# Altium schematic sheet FC-Shield.SchDoc
size A4
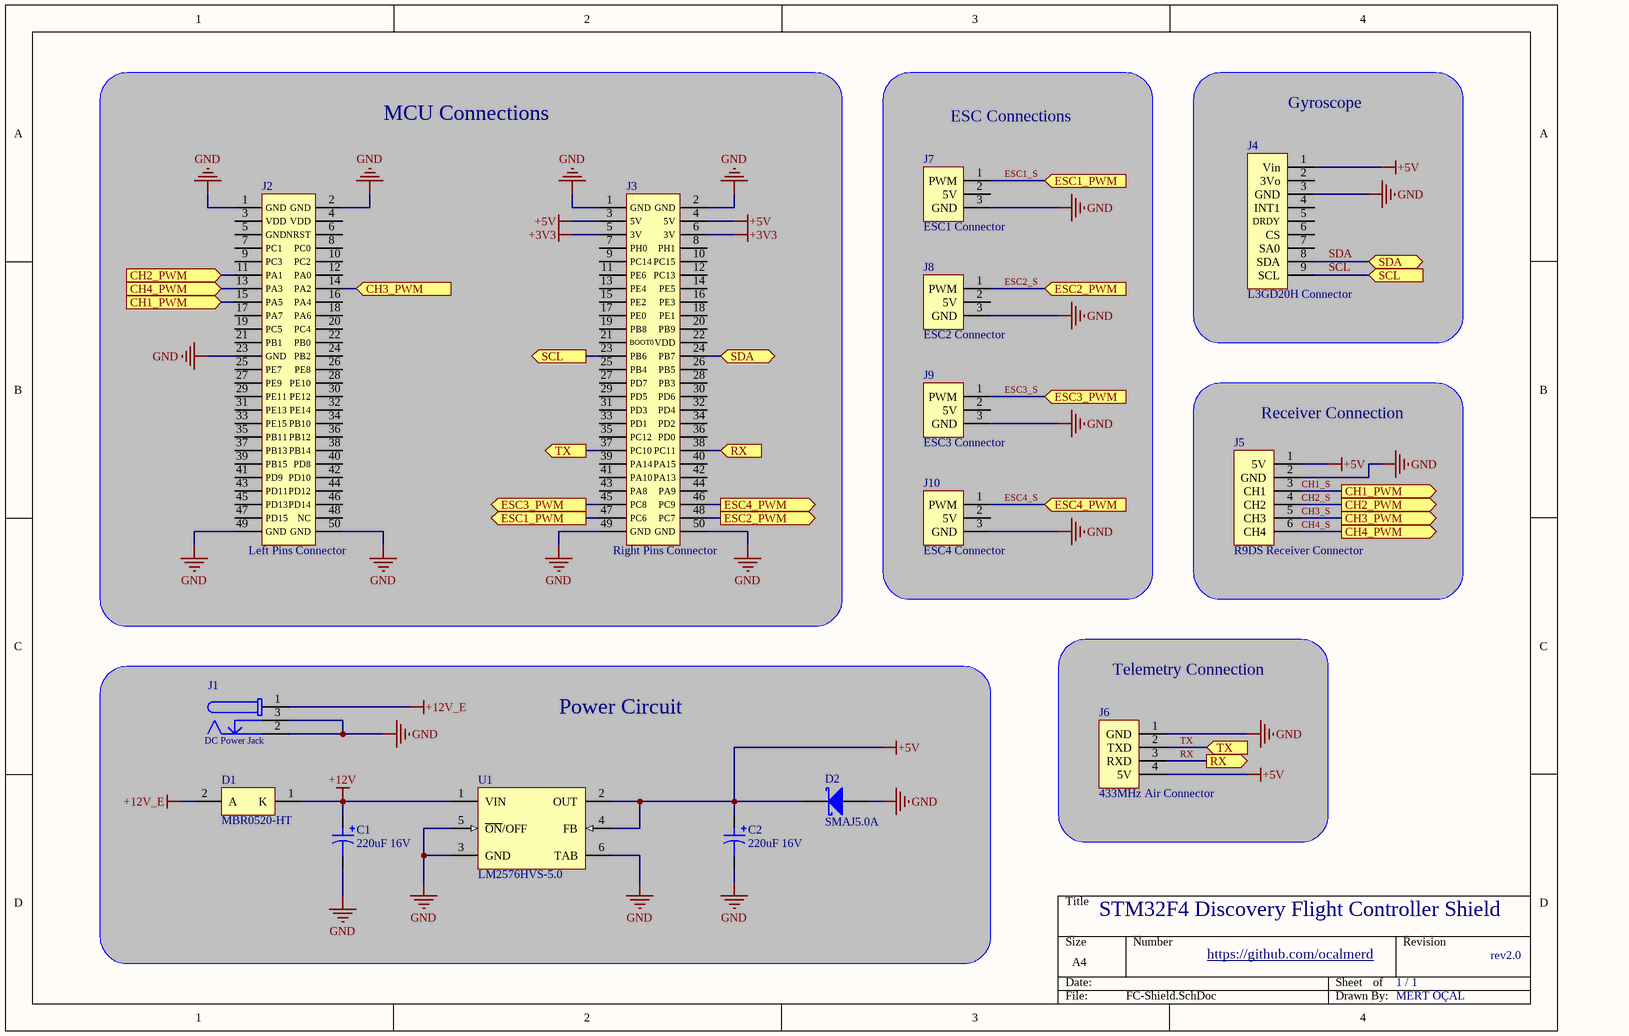
[diagram p0: FC-Shield.SchDoc]

## Parts
C1  Deger: 220uF 16V  [CAP ALUM 6.6MM]  (hidden comment: CAP ALUM 220UF 20% 16V SMD)
C2  Deger: 220uF 16V  [CAP ALUM 6.6MM]  (hidden comment: CAP ALUM 220UF 20% 16V SMD)
D1  MBR0520-HT  [ONSC-SOD-123-2-425-04_V]
D2  SMAJ5.0A TVS Diyot  [DO214AC SMA]  (value not drawn)
J1  DC Power Jack  [694106301002]
J2  Left Pins Connector  [HDR2X25]
J3  Right Pins Connector  [HDR2X25]
J4  L3GD20H Connector  [HDR1X9]
J5  R9DS Receiver Connector  [HDR1X6H]
J6  433MHz Air Connector  [HDR1X4H]
J7  ESC1 Connector  [HDR1X3H]
J8  ESC2 Connector  [HDR1X3H]
J9  ESC3 Connector  [HDR1X3H]
J10  ESC4 Connector  [HDR1X3H]
U1  Deger: LM2576HVS-5.0  [TO-263-6]  (hidden comment: LM2576HVS-5.0 REG BUCK 5V 3A TO263-5)

## Blocks framed on the sheet
MCU Connections: J2 J3
ESC Connections: J7-J10
Gyroscope: J4
Receiver Connection: J5
Power Circuit: C1 C2 D1 D2 J1 U1
Telemetry Connection: J6

## Ports
CH1_PWM (in), CH1_PWM (out), CH2_PWM (in), CH2_PWM (out), CH3_PWM (in), CH3_PWM (out), CH4_PWM (in), CH4_PWM (out), ESC1_PWM (in), ESC1_PWM (out), ESC2_PWM (in), ESC2_PWM (out), ESC3_PWM (in), ESC3_PWM (out), ESC4_PWM (in), ESC4_PWM (out), RX (in), RX (out), SCL (in), SCL (out), SDA (bidir), TX (in), TX (out)

## Nets
+3V3: J3.5(3V) J3.6(3V)
+5V: C2.1 D2.2(K) J3.3(5V) J3.4(5V) J4.1(Vin) J5.1(5V) J6.4(5V) U1.2(OUT) U1.4(FB)
+12V: C1.1 D1.1(K) U1.1(VIN)
+12V_E: D1.2(A) J1.1
GND: C1.2 C2.2 D2.1(A) J1.2 J1.3 J2.1(GND) J2.2(GND) J2.23(GND) J2.49(GND) J2.50(GND) J3.1(GND) J3.2(GND) J3.49(GND) J3.50(GND) J4.3(GND) J5.2(GND) J6.1(GND) J7.3(GND) J8.3(GND) J9.3(GND) J10.3(GND) U1.3(GND) U1.5(~{ON}/OFF) U1.6(TAB)
CH1_S: J2.15(PA5) J5.3(CH1) ; port CH1_PWM
CH2_S: J2.11(PA1) J5.4(CH2) ; port CH2_PWM
CH3_S: J2.14(PA2) J5.5(CH3) ; port CH3_PWM
CH4_S: J2.13(PA3) J5.6(CH4) ; port CH4_PWM
ESC1_S: J3.47(PC6) J7.1(PWM) ; port ESC1_PWM
ESC2_S: J3.48(PC7) J8.1(PWM) ; port ESC2_PWM
ESC3_S: J3.45(PC8) J9.1(PWM) ; port ESC3_PWM
ESC4_S: J3.46(PC9) J10.1(PWM) ; port ESC4_PWM
RX: J3.38(PC11) J6.3(RXD) ; port RX
SCL: J3.23(PB6) J4.9(SCL) ; port SCL
SDA: J3.24(PB7) J4.8(SDA) ; port SDA
TX: J3.37(PC10) J6.2(TXD) ; port TX

Not connected (* = marked no-connect by the designer): J2 3(VDD) 4(VDD) 5(GND) 6(NRST) 7(PC1) 8(PC0) 9(PC3) 10(PC2) 12(PA0) 16(PA4) 17(PA7) 18(PA6) 19(PC5) 20(PC4) 21(PB1) 22(PB0) 24(PB2) 25(PE7) 26(PE8) 27(PE9) 28(PE10) 29(PE11) 30(PE12) 31(PE13) 32(PE14) 33(PE15) 34(PB10) 35(PB11) 36(PB12) 37(PB13) 38(PB14) 39(PB15) 40(PD8) 41(PD9) 42(PD10) 43(PD11) 44(PD12) 45(PD13) 46(PD14) 47(PD15) 48(NC); J3 7(PH0) 8(PH1) 9(PC14) 10(PC15) 11(PE6) 12(PC13) 13(PE4) 14(PE5) 15(PE2) 16(PE3) 17(PE0) 18(PE1) 19(PB8) 20(PB9) 21(BOOT0) 22(VDD) 25(PB4) 26(PB5) 27(PD7) 28(PB3) 29(PD5) 30(PD6) 31(PD3) 32(PD4) 33(PD1) 34(PD2) 35(PC12) 36(PD0) 39(PA14) 40(PA15) 41(PA10) 42(PA13) 43(PA8) 44(PA9); J4 2(3Vo) 4(INT1) 5(DRDY) 6(CS) 7(SA0); J7 2(5V); J8 2(5V); J9 2(5V); J10 2(5V)

## Notes on the sheet
- STM32F4 Discovery Flight Controller Shield
- https://github.com/ocalmerd
- 1 / 1
- rev2.0
- MERT ÖÇAL
- Title
- Size:
- Date:
- A4
- Number:
- Time:
- Revision:
- Sheet
- of
- File:

## Library data of the parts
C1 C2 = 100uF 16V Aluminum(POL): 220µF 16V Aluminum Electrolytic Capacitors Radial, Can - SMD  1000 Hrs @ 105°C; Kılıf: 6.60mm x 6.60mm; Cins: Kondansator; Uretici Kodu: EEE-HA1C101WP; -Sicaklik: -40; +Sicaklik: +105; Nero Kodu: NE-S-00400; Yıkama Bilgisi: UYGUN; Epoksi Bilgisi: VAR; Kaplama Bilgisi: UYGUN; MSL: 1 (Unlimited); Lehim Yöntemi: SMD
D1 = MBR0520LT1: 20V 0.5A Schottky Power Rectifier, 2-Pin SOD-123, Tape and Reel; Manufacturer: On Semiconductor; Configuration: Single; IFSM Max (A): 5.5; DatasheetVersion: Rev. 6; PackageVersion: Rev. G, 10/2009; PackageReference: SOD-123-2-425-04; PackageDescription: 2-Pin SOD, Body 1.6 x 2.69 mm; Supplier 1: Digi-Key; Supplier Part Number 1: MBR0520LT1OSCT-ND; Packing: Tape and Reel; RoHS: FALSE; Mounting Technology: Surface Mount; PartNumber: MBR0520LT1; ComponentLink1Description: Manufacturer URL; ComponentLink1URL: http://www.onsemi.com/; ComponentLink2Description: Datasheet; ComponentLink2URL: http://www.onsemi.cn/pub_link/Collateral/MBR0520LT1-D.PDF; ComponentLink3Description: Package Specification; ComponentLink3URL: http://www.onsemi.com/pub_link/Collateral/425-04.PDF
D2 = SMAJ5.0A: Schottky Rectifier; Kılıf: DO-214AC; -Sicaklik: -55; +Sicaklik: +150; Lehim Yöntemi: SMD; Epoksi Bilgisi: YOK; Kaplama Bilgisi: UYGUN; Nero Kodu: NE-S-00888; Cins: Diyot; Uretici Kodu: SMAJ5.0A; MSL: 1 (Unlimited); Yıkama Bilgisi: UYGUN; ComponentLink1Description: https://www.digikey.com/product-detail/en/littelfuse-inc/SMAJ5.0A/SMAJ5.0ALFTR-ND/762250; ComponentLink1URL: *; Deger: SMAJ5.0A
J1 = 694106301002: DC Power Jack Connector WR-DC, Male, Right Angled, THT, 5 A, 24 V; Opening Diameter: 6.4 mm; Plug Inner Diameter: 2.05 mm; Plug Outer Diameter: 5.5 mm; Rated Current: 5 A; Working Voltage: 24 V; ComponentLink1Description: Manufacturer; ComponentLink1URL: http://www.we-online.de; ComponentLink2Description: Datasheet; ComponentLink2URL: http://katalog.we-online.de/em/datasheet/6941xx301002.pdf; Part Number: 694106301002; Published Date: August 2018; Publisher: Wurth Elektronik; Orientation: Right Angled; Operating Temperature: -40 to 85 degC; Mounting Technology: THT; Gender: Male; Packaging: Bag
J2 J3 = Header 25X2: Header, 25-Pin, Dual row; LatestRevisionDate: 17-Jul-2002; LatestRevisionNote: Re-released for DXP Platform.; Publisher: Altium Limited
J4 = Header 9: Header, 9-Pin; LatestRevisionDate: 17-Jul-2002; LatestRevisionNote: Re-released for DXP Platform.; Publisher: Altium Limited
J5 = Header 6H: Header, 6-Pin, Right Angle; LatestRevisionDate: 17-Jul-2002; LatestRevisionNote: Re-released for DXP Platform.; Publisher: Altium Limited
J6 = Header 4H: Header, 4-Pin, Right Angle; LatestRevisionDate: 17-Jul-2002; LatestRevisionNote: Re-released for DXP Platform.; Publisher: Altium Limited
J7-J10 = Header 3H: Header, 3-Pin, Right Angle; LatestRevisionDate: 17-Jul-2002; LatestRevisionNote: Re-released for DXP Platform.; Publisher: Altium Limited
U1 = LM2576HVS-5.0--: Buck Switching Regulator IC Positive Fixed 5V 1 Output 3A TO-263-6, D²Pak (5 Leads + Tab), TO-263BA; Kılıf: D2PAK-3; -Sicaklik: -40; +Sicaklik: +125; Yıkama Bilgisi: UYGUN; Epoksi Bilgisi: YOK; Lehim YöntemiLehim Yönetmi: SMD; Cins: IC; Uretici Kodu: LM2576HVS-5.0; Kaplama Bilgisi: UYGUN; MSL: 1 (Unlimited)